# Altium schematic sheet Alimentation.SchDoc
size A3; Organization: ETML-ES; Address1: Avenue Recordon 1; Address2: 1004 Lausanne; Address3: Switzerland; SheetNumber: 2; SheetTotal: 3; SPICEModelCacheYOBDUZTY: <root> / <DocumentId>YOBDUZTY</DocumentId> / <CacheFrame Number="0"> / <Model Name="skydiode" Kind="MDL"> / <Text>*Default Schottky Diode / *Schottky Diode Pinout: A,K / .MODEL SKYDIODE D(EG=0.69 XTI=2)</Text> / </Model> / </CacheFrame> / </root>
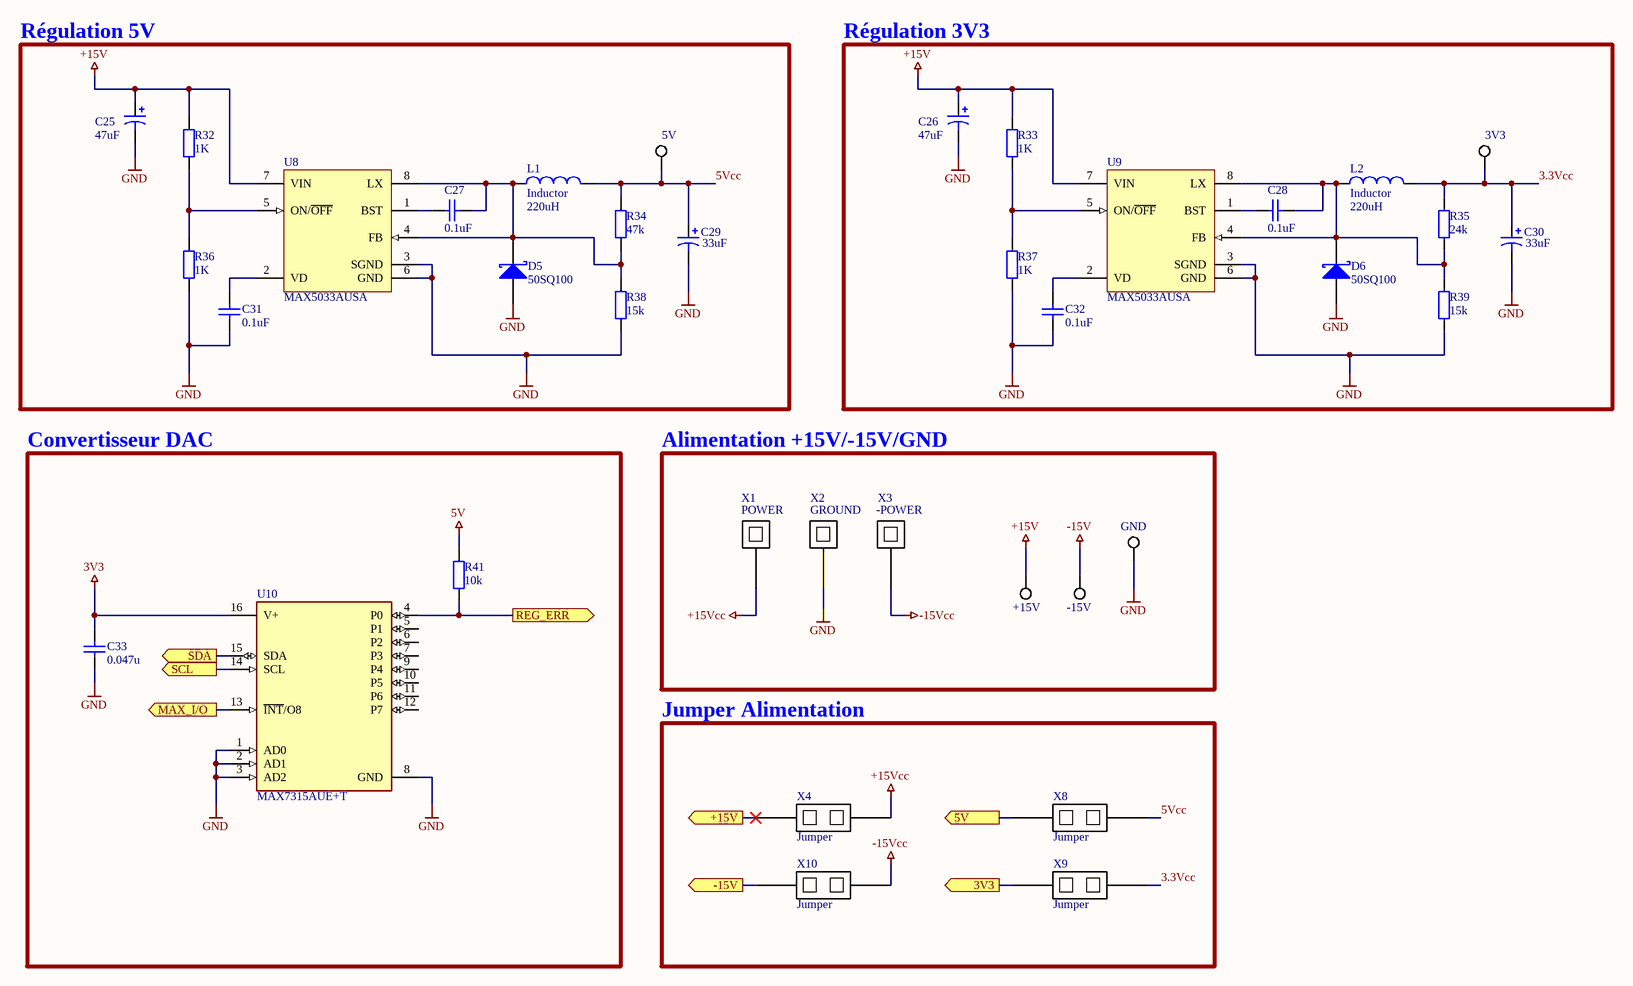
[diagram p0: Alimentation.SchDoc]

## Parts
3V3  REGP  [KSTN-5019_V]  (value not drawn)
5V  REGP  [KSTN-5019_V]  (value not drawn)
+15V  REGP  [KSTN-5019_V]  (value not drawn)
-15V  REGP  [KSTN-5019_V]  (value not drawn)
C25  value 47uF  [C0805]  (hidden comment: Cap Pol1)
C26  value 47uF  [C0805]  (hidden comment: Cap Pol1)
C27  value 0.1uF  [C0805]  (hidden comment: Cap)
C28  value 0.1uF  [C0805]  (hidden comment: Cap)
C29  value 33uF  [C0805]  (hidden comment: Cap Pol1)
C30  value 33uF  [C0805]  (hidden comment: Cap Pol1)
C31  value 0.1uF  [C0805]  (hidden comment: Cap)
C32  value 0.1uF  [C0805]  (hidden comment: Cap)
C33  value 0.047u  [C0805]  (hidden comment: Cap)
D5  50SQ100  [SODFL2513X70N]
D6  50SQ100  [SODFL2513X70N]
GND  REGP  [KSTN-5019_V]  (value not drawn)
L1  Inductor  value 220uH  [SDE0604A101K]
L2  Inductor  value 220uH  [SDE0604A101K]
R32  value 1K  [6-0805_N]  (hidden comment: Res2)
R33  value 1K  [6-0805_N]
R34  value 47k  [6-0805_N]  (hidden comment: Res2)
R35  value 24k  [6-0805_N]  (hidden comment: Res2)
R36  value 1K  [6-0805_N]  (hidden comment: Res2)
R37  value 1K  [6-0805_N]
R38  value 15k  [6-0805_N]  (hidden comment: Res2)
R39  value 15k  [6-0805_N]  (hidden comment: Res2)
R41  value 10k  [6-0805_N]  (hidden comment: Res2)
U8  MAX5033AUSA  [S8-5_N]
U9  MAX5033AUSA  [S8-5_N]
U10  MAX7315AUE+T  [FP-U16-2-MFG]
X1  POWER  [PIN1]
X2  GROUND  [PIN1]
X3  -POWER  [PIN1]
X4  Jumper  [HDR1X2]
X8  Jumper  [HDR1X2]
X9  Jumper  [HDR1X2]
X10  Jumper  [HDR1X2]

## Blocks framed on the sheet
Régulation 5V: 5V C25 C27 C29 C31 D5 L1 R32 R34 R36 R38 U8
Régulation 3V3: 3V3 C26 C28 C30 C32 D6 L2 R33 R35 R37 R39 U9
Convertisseur DAC: C33 R41 U10
Alimentation +15V/-15V/GND: +15V -15V GND X1-X3
Jumper Alimentation: X4 X8-X10

## Ports
3V3 (out, see uC_HMI[1D]), 5V (out, see uC_HMI[1D]), +15V (out, see Regulation_PID[1D], uC_HMI[1D]), -15V (out, see Regulation_PID[1D]), MAX_I/O (out, see uC_HMI[2A]), REG_ERR (out, see Regulation_PID[1B]), SCL (out, see uC_HMI[6A]), SDA (out, see uC_HMI[6A])

## Nets
3V3: C33.2 U10.16(V+)
5V: R41.2
+15V: +15V.1 C25.1 C26.1 R32.2 R33.2 U8.7(VIN) U9.7(VIN)
+15Vcc: X1.1 X4.2
-15V: -15V.1
-15Vcc: X3.1 X10.2
GND: C25.2 C26.2 C29.2 C30.2 C31.2 C32.2 C33.1 D5.1(A) D6.1(A) GND.1 R36.1 R37.1 R38.1 R39.1 U8.3(SGND) U8.6(GND) U9.3(SGND) U9.6(GND) U10.1(AD0) U10.2(AD1) U10.3(AD2) U10.8(GND) X2.1
3.3Vcc: 3V3.1 C30.1 L2.2 R35.2 X9.2
3V3: X9.1 ; port 3V3  [a separate net that carries the same name]
5V: X8.1 ; port 5V  [a separate net that carries the same name]
5Vcc: 5V.1 C29.1 L1.2 R34.2 X8.2
+15V: X4.1 ; port +15V  [a separate net that carries the same name]
-15V: X10.1 ; port -15V  [a separate net that carries the same name]
MAX_I/O: U10.13(~{INT}/O8) ; port MAX_I/O
REG_ERR: R41.1 U10.4(P0) ; port REG_ERR
SCL: U10.14(SCL) ; port SCL
SDA: U10.15(SDA) ; port SDA
NetC27_1: C27.1 U8.1(BST)
NetC27_2: C27.2 D5.2(K) L1.1 R34.1 R38.2 U8.4(FB) U8.8(LX)
NetC28_1: C28.1 U9.1(BST)
NetC28_2: C28.2 D6.2(K) L2.1 R35.1 R39.2 U9.4(FB) U9.8(LX)
NetC31_1: C31.1 U8.2(VD)
NetC32_1: C32.1 U9.2(VD)
NetR32_1: R32.1 R36.2 U8.5(ON/~{OFF})
NetR33_1: R33.1 R37.2 U9.5(ON/~{OFF})

Not connected (* = marked no-connect by the designer): U10 5(P1) 6(P2) 7(P3) 9(P4) 10(P5) 11(P6) 12(P7)

## Notes on the sheet
- Fichier :
- a
- Date :
- Heure :
- Version :
- Auteur :
- Modif.
- b
- c
- d
- Projet :
- No :
- Nb feuilles
- Feuille n°
- Chemin :

## Library data of the parts
3V3 5V +15V -15V GND = CMP-1672-00008-1: Test Point, 1 Position SMD, RoHS, Tape and Reel; ComponentLink1Description: Manufacturer URL; Package Quantity: 1000; DatasheetVersion: 03/2014; Packaging: Tape and Reel; ComponentLink2URL: http://www.keyelco.com/product-pdf.cfm?p=1357; ComponentLink1URL: http://www.keyelco.com/; Mount: Surface Mount; Contact Plating: Silver; PackageDescription: 1-Pin Surface Mount Device, Body 3.81 x 2.03 mm; Pins: 1; RoHSCompliant: True; Mounting Technology: Surface Mount; ComponentLink2Description: Datasheet; PackageReference: 5019
C25 C26 = Cap Pol1: Cap Pol 47uF; Published: 8-Jun-2000; LatestRevisionDate: 17-Jul-2002; LatestRevisionNote: Re-released for DXP Platform.; PackageReference: RB7.6-15; Publisher: Altium Limited; PackageDescription: Polarized Capacitor (Radial); 2 Leads
C27 C28 C31 C32 = Cap: Cap 100nF; Published: 8-Jun-2000; LatestRevisionDate: 17-Jul-2002; LatestRevisionNote: Re-released for DXP Platform.; PackageReference: RAD-0.3; Publisher: Altium Limited; PackageDescription: Radial Cap, Thru-Hole; 2 Leads; 0.3 in Pin Spacing
C29 C30 = Cap Pol1: Cap Pol 33uF; Published: 8-Jun-2000; LatestRevisionDate: 17-Jul-2002; LatestRevisionNote: Re-released for DXP Platform.; PackageReference: RB7.6-15; Publisher: Altium Limited; PackageDescription: Polarized Capacitor (Radial); 2 Leads
C33 = Cap: Cap 0.047uF; Published: 8-Jun-2000; LatestRevisionDate: 17-Jul-2002; LatestRevisionNote: Re-released for DXP Platform.; PackageReference: RAD-0.3; Publisher: Altium Limited; PackageDescription: Radial Cap, Thru-Hole; 2 Leads; 0.3 in Pin Spacing
D5 D6 = D Schottky: Schottky Diode 50SQ100; Published: 8-Jun-2000; LatestRevisionDate: 17-Jul-2002; LatestRevisionNote: Re-released for DXP Platform.; PackageReference: SMB; Publisher: Altium Limited; PackageDescription: DO-214-AA/SMB; 2 C-Bend Leads; Body 5.3 x 3.6 mm, inc. leads (LxW); Code_JEDEC: DO-214-AA
L1 L2 = Inductor: Inductor 220uH; Code_IEC: 1005; Published: 8-Jun-2000; LatestRevisionDate: 29-May-2009; LatestRevisionNote: IPC-7351 Footprint Added.; PackageReference: 0402-A; Publisher: Altium Limited; PackageDescription: Chip Inductor; Code_JEITA: 0402
R32 R33 R36 R37 = Res2: Res 1K; Published: 8-Jun-2000; LatestRevisionDate: 17-Jul-2002; LatestRevisionNote: Re-released for DXP Platform.; PackageReference: AXIAL-0.4; Publisher: Altium Limited; PackageDescription: Axial Device, Thru-Hole; 2 Leads; 0.4 in Pin Spacing
R34 R38 = Res2: Resistor; Published: 8-Jun-2000; LatestRevisionDate: 17-Jul-2002; LatestRevisionNote: Re-released for DXP Platform.; PackageReference: AXIAL-0.4; Publisher: Altium Limited; PackageDescription: Axial Device, Thru-Hole; 2 Leads; 0.4 in Pin Spacing
R35 = Res2: Res 24K; Published: 8-Jun-2000; LatestRevisionDate: 17-Jul-2002; LatestRevisionNote: Re-released for DXP Platform.; PackageReference: AXIAL-0.4; Publisher: Altium Limited; PackageDescription: Axial Device, Thru-Hole; 2 Leads; 0.4 in Pin Spacing
R39 = Res2: Res 15K; Published: 8-Jun-2000; LatestRevisionDate: 17-Jul-2002; LatestRevisionNote: Re-released for DXP Platform.; PackageReference: AXIAL-0.4; Publisher: Altium Limited; PackageDescription: Axial Device, Thru-Hole; 2 Leads; 0.4 in Pin Spacing
R41 = Res2: Res 10K; Published: 8-Jun-2000; LatestRevisionDate: 17-Jul-2002; LatestRevisionNote: Re-released for DXP Platform.; PackageReference: AXIAL-0.4; Publisher: Altium Limited; PackageDescription: Axial Device, Thru-Hole; 2 Leads; 0.4 in Pin Spacing
U8 U9 = CMP-0246-00246-1: 500mA, 76V, High-Efficiency, MAXPower(TM) Step-Down DC-DC Converter, 3.3V output, 8-Pin SOIC, 0°C to +85°C; ComponentLink3URL: http://pdfserv.maxim-ic.com/package_dwgs/21-0041.PDF; Code_IPC: SOIC127P600-8; Code_JEDEC: MS-012-AA; PackageReference: S8-5; ComponentLink2URL: http://datasheets.maxim-ic.com/en/ds/MAX5033.pdf; DatasheetVersion: Rev 5, May-2011; ComponentLink1URL: http://www.maxim-ic.com; ComponentLink1Description: Manufacturer URL; ComponentLink2Description: Datasheet; PackageVersion: revC, 2010; PackageDescription: 8-Pin Small-Outline IC, Narrow (0.15in), 1.27 mm Pitch, SOIC (N); ComponentLink3Description: Package Specification
U10 = CMP-05690-000009-1: IC I/O EXPANDER I2C 8B 16TSSOP; Number of I/Os: 8; Power Dissipation: 1.176W; Frequency: 400kHz; Operating Supply Voltage: 3.6V; Output Current: 50mA; Min Operating Temperature: -40°C; RoHS Compliant: Yes; Case/Package: TSSOP; Mount: Surface Mount; Number of Pins: 16; Packaging: Tape and Reel; Interface: I2C; Lead Free: Lead Free; Max Operating Temperature: 125°C; Package Quantity: 2500; Max Frequency: 400kHz; Series: -
X1-X3 = Berg: CONN HEADER VERT 1POS; Supplier: Stock ES
X4 X8-X10 = Jumper: CONN HEADER VERT 2POS 2.54MM; Supplier: Mouser; Supplier Ref.: 710-61300211121; Supplier unit price: 0.119